# EAGLE design Akizuki_LCD1602 (EAGLE 7.2.0)
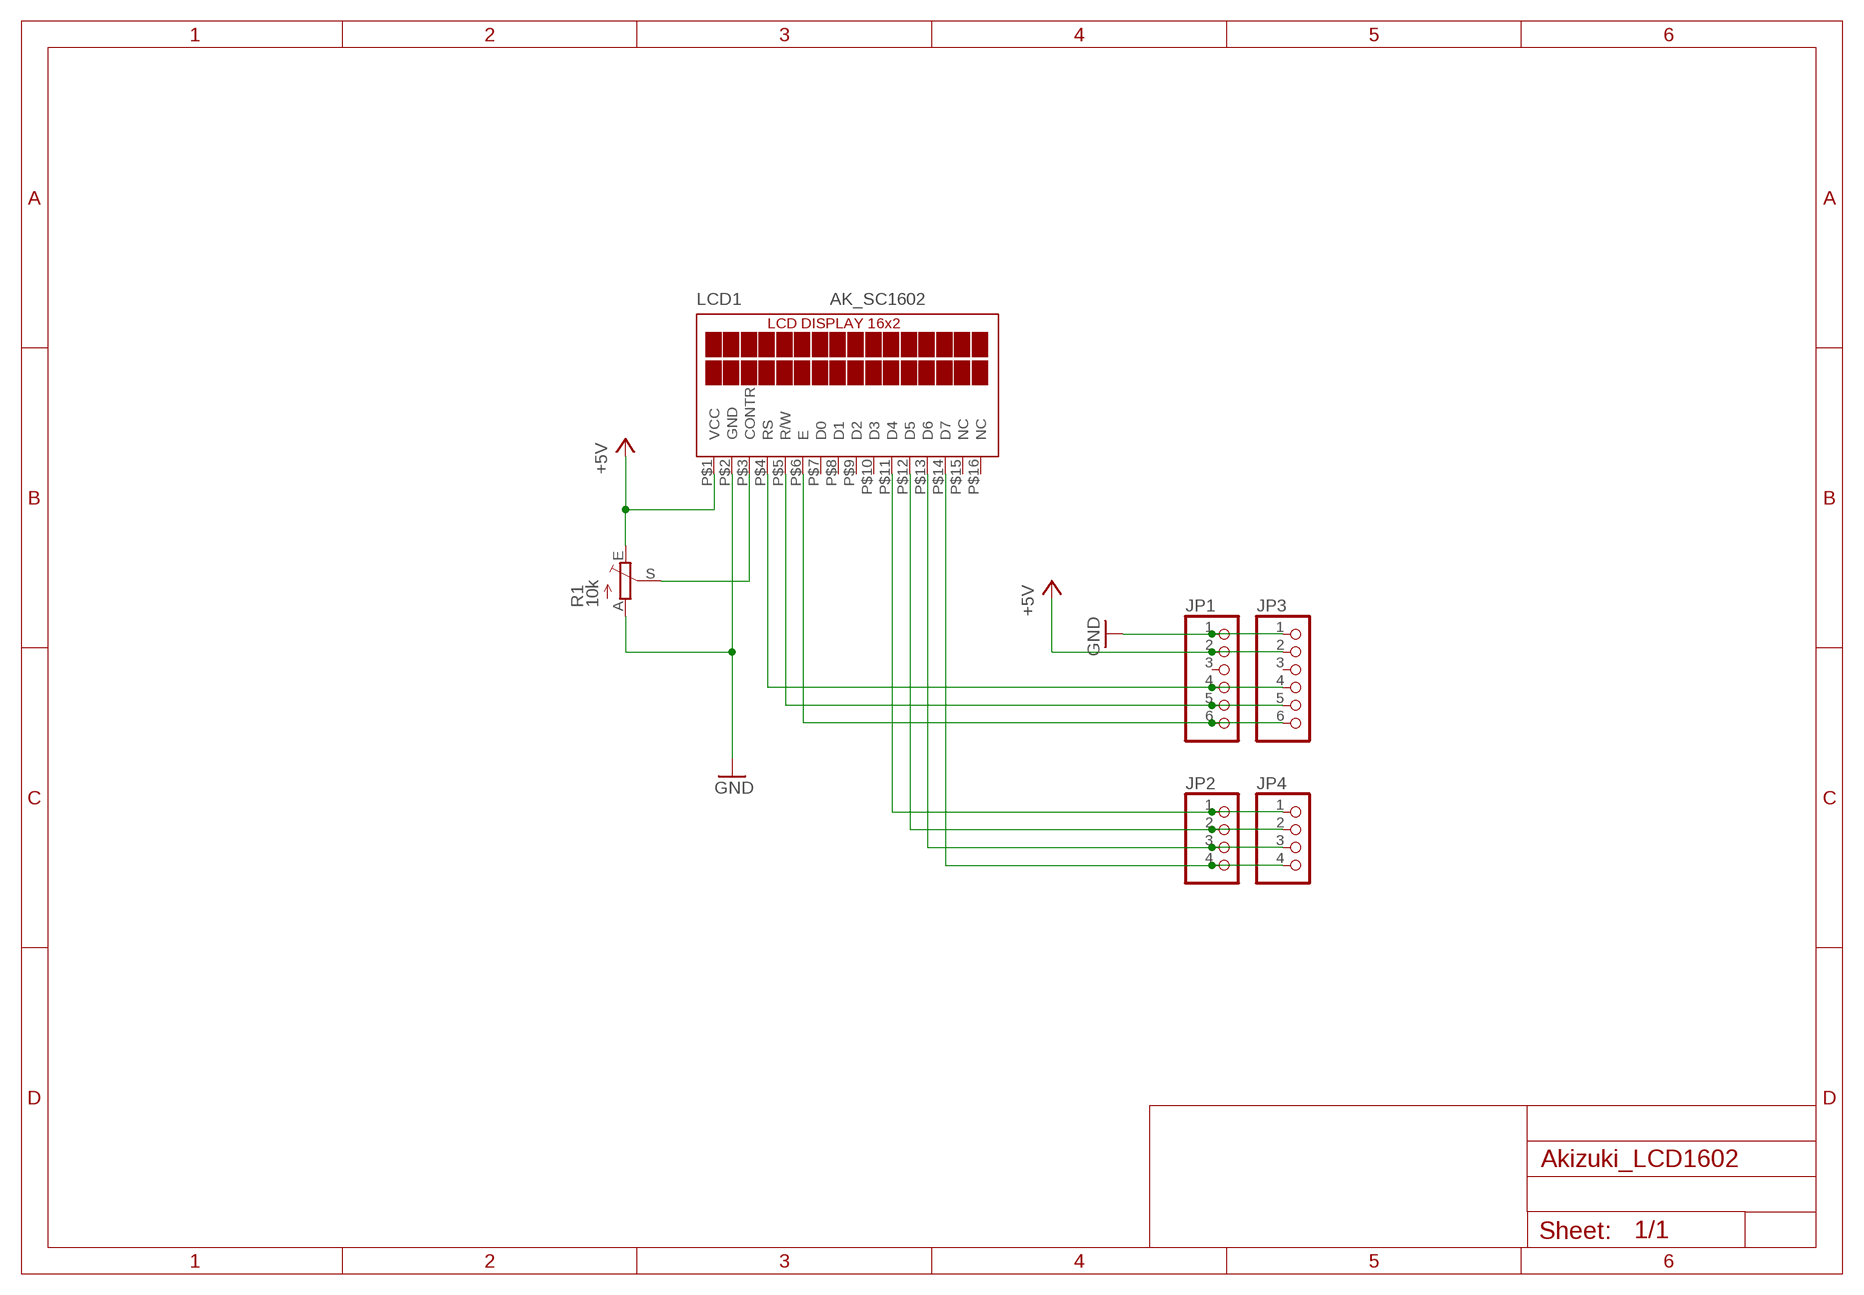
[diagram p0: schematic, sheet 1]

## Parts
JP1  PINHD-1X6  [1X06]
JP2  PINHD-1X4  [1X04]
JP3  PINHD-1X6  [1X06]
JP4  PINHD-1X4  [1X04]
LCD1  AK_SC1602  [AK_SC1602]
R1  10k  TRIM_EU-B25P  [B25P]

## Nets
+5V: JP1.2 JP3.2 LCD1.P$1(VCC) R1.E
GND: JP1.1 JP3.1 LCD1.P$2(GND) R1.A
N$1: LCD1.P$3(CONTR) R1.S
N$2: JP1.4 JP3.4 LCD1.P$4(RS)
N$3: JP1.5 JP3.5 LCD1.P$5(R/W)
N$4: JP1.6 JP3.6 LCD1.P$6(E)
N$5: JP2.1 JP4.1 LCD1.P$11(D4)
N$6: JP2.2 JP4.2 LCD1.P$12(D5)
N$7: JP2.3 JP4.3 LCD1.P$13(D6)
N$11: JP2.4 JP4.4 LCD1.P$14(D7)
Unconnected: JP1.3 JP3.3 LCD1.P$7(D0) LCD1.P$8(D1) LCD1.P$9(D2) LCD1.P$10(D3) LCD1.P$15(NC) LCD1.P$16(NC)

## Library data of the parts
JP1 JP3 = pinhead:PINHD-1X6: PIN HEADER
JP2 JP4 = pinhead:PINHD-1X4: PIN HEADER
LCD1 = mylib2:AK_SC1602: 秋月ＬＣＤキャラクタディスプレイモジュール（１６×２行）
R1 = pot:TRIM_EU-: POTENTIOMETER

## Board
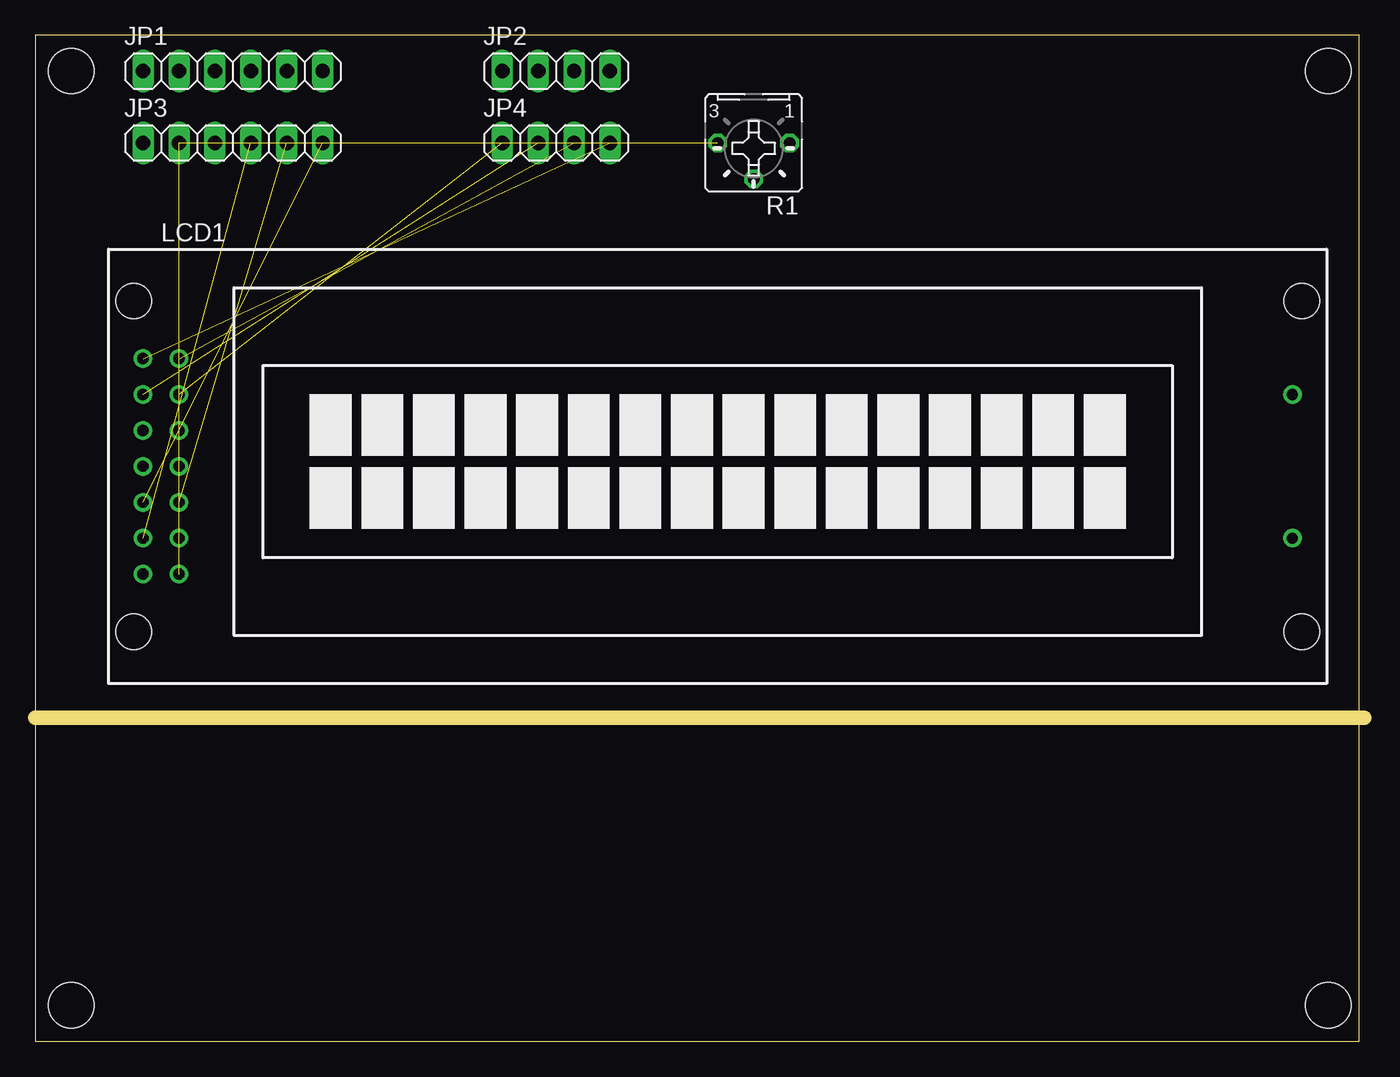
[diagram p1: board, top side]
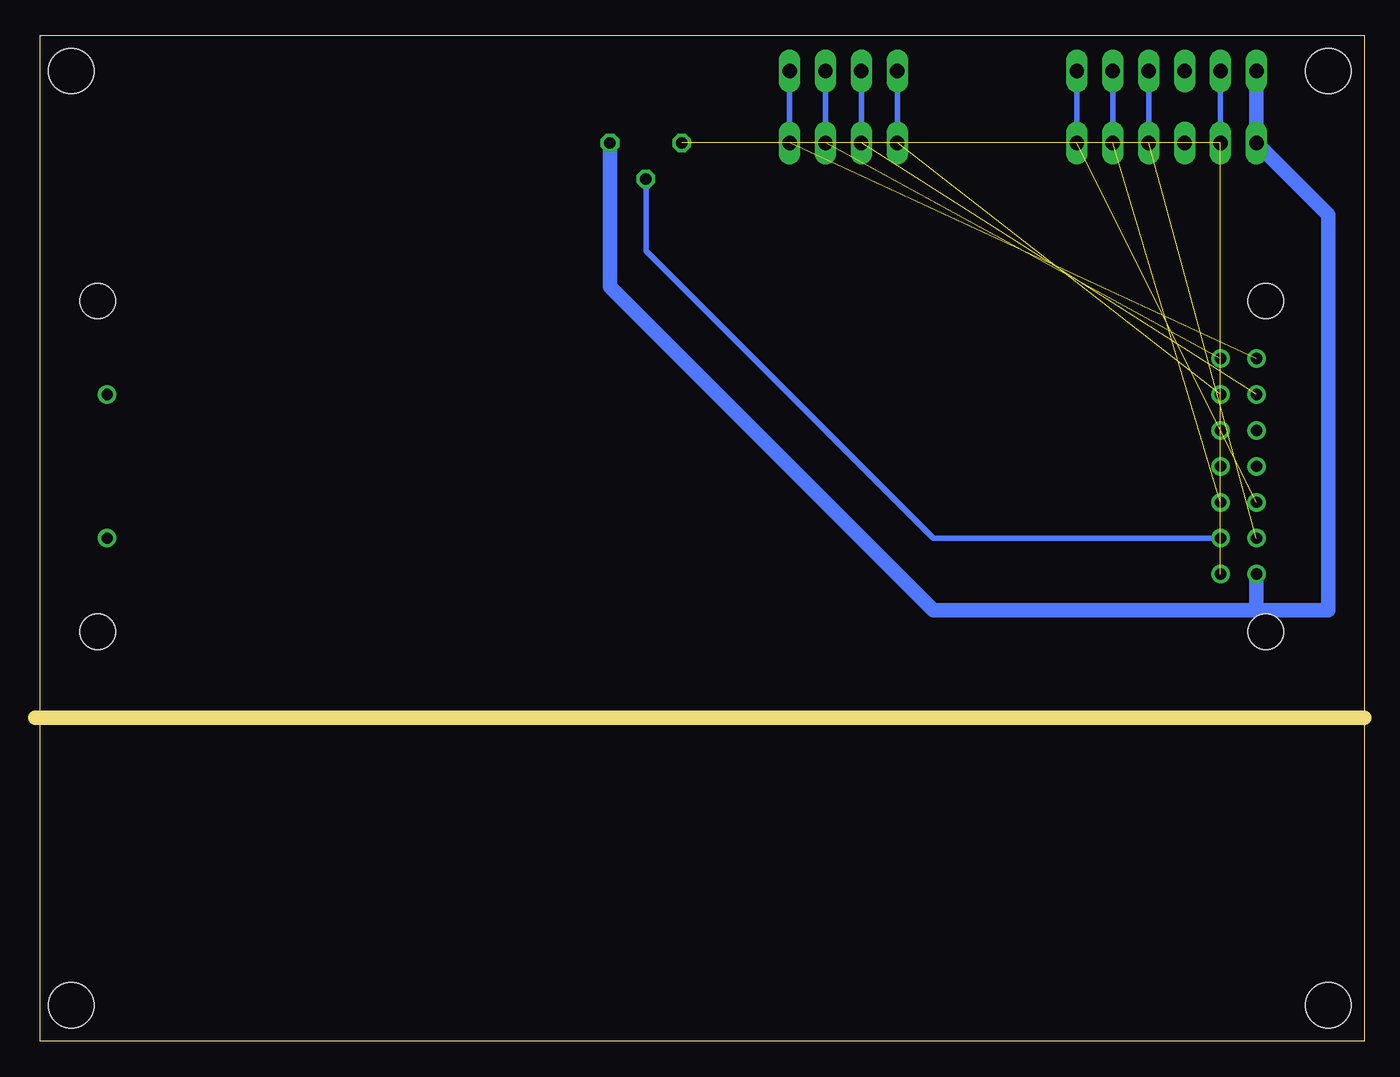
[diagram p2: board, bottom side, seen from below]

Size 93.98 x 71.11 mm. Coordinates in mm from the lower left corner, seen from the top.
Outline: 0,22.86 0,71.11 93.65,71.11 93.65,0 0,0 0,22.86
Outline: 0,22.86 93.98,22.86
Copper layers (1*16): Top 0.035mm / dielectric 1.5mm / Bottom 0.035mm
Design rules "default": minimum track width 10mil, minimum drill 24mil, track to track 8mil, track to pad 8mil, pad to pad 8mil, via to via 8mil, smd to smd 8mil, copper to edge 40mil, drill to drill 8mil, minimum pad ring 10mil, minimum via ring 8mil, stop-mask expansion 4mil, vias tented up to drill 0mil, thermal gap 10mil
Holes 3.2 mm at 2.54,68.58 2.54,2.54 91.44,2.54 91.44,68.58

### Footprints (pad centres in the part's own frame; a part is rotated, then mirrored left to right if it is on the bottom)
1X06 = drill 1.016 long: 1 -6.35,0; 2 -3.81,0; 3 -1.27,0; 4 1.27,0; 5 3.81,0; 6 6.35,0
1X04 = drill 1.016 long: 1 -3.81,0; 2 -1.27,0; 3 1.27,0; 4 3.81,0
AK_SC1602 = drill 0.8: P$1 -35.56,-7.62; P$2 -38.1,-7.62; P$3 -35.56,-5.08; P$4 -38.1,-5.08; P$5 -35.56,-2.54; P$6 -38.1,-2.54; P$7 -35.56,0; P$8 -38.1,0; P$9 -35.56,2.54; P$10 -38.1,2.54; P$11 -35.56,5.08; P$12 -38.1,5.08; P$13 -35.56,7.62; P$14 -38.1,7.62; P$15 43.18,5.08; P$16 43.18,-5.08 | hole 2.5: -38.77,-11.69; 43.85,-11.69; -38.77,11.69; 43.85,11.69
B25P = drill 0.813 octagon: A -2.54,0; E 2.54,0; S 0,2.54

### Placement (x,y rotation side)
JP1  13.97,68.58 0 top
JP2  36.83,68.58 0 top
JP3  13.97,63.5 0 top
JP4  36.83,63.5 0 top
LCD1  45.72,40.64 0 top
R1  50.8,63.5 180 top

### Tracks (layer width: path | path; a pad name or v marks a point on that pad's centre or on a via)
+5V  (2 unrouted)
  Bottom 0.406: JP1.2 JP3.2
GND
  Bottom 1.016: R1.A 53.34,53.34 30.48,30.48 7.62,30.48 | JP1.1 JP3.1 2.54,58.42 2.54,30.48 7.62,30.48 | LCD1.P$2 7.62,30.48
N$1
  Bottom 0.406: LCD1.P$3 30.48,35.56 50.8,55.88 R1.S
N$2  (1 unrouted)
  Bottom 0.406: JP1.4 JP3.4
N$3  (1 unrouted)
  Bottom 0.406: JP1.5 JP3.5
N$4  (1 unrouted)
  Bottom 0.406: JP1.6 JP3.6
N$5  (1 unrouted)
  Bottom 0.406: JP2.1 JP4.1
N$6  (1 unrouted)
  Bottom 0.406: JP2.2 JP4.2
N$7  (1 unrouted)
  Bottom 0.406: JP2.3 JP4.3
N$11  (1 unrouted)
  Bottom 0.406: JP2.4 JP4.4

### Text on the board
Document: Cut Off